# EAGLE schematic Commander (EAGLE 7.7.0)
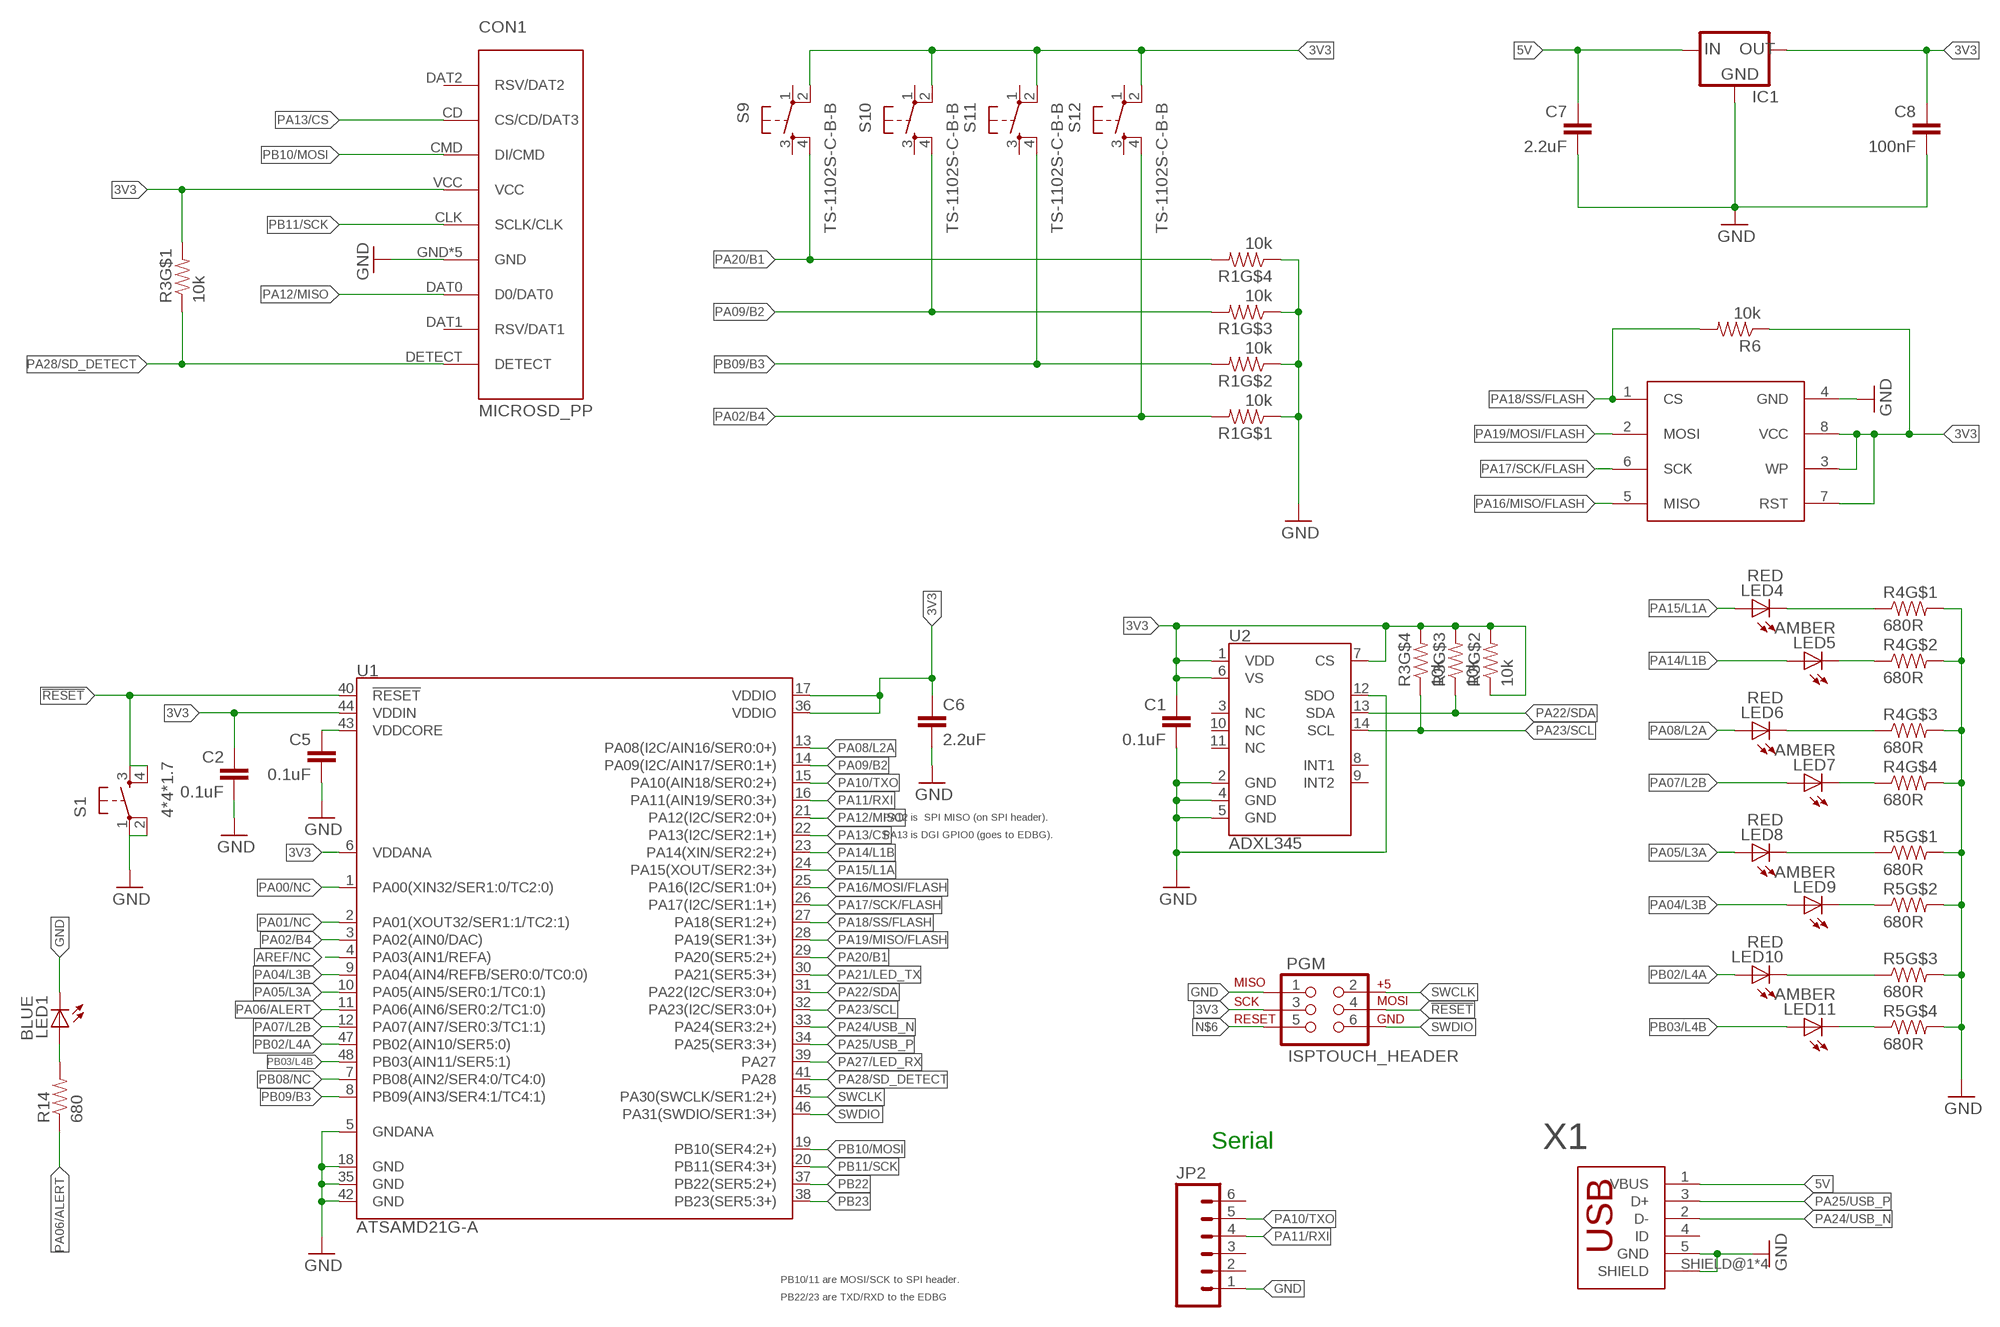
[diagram p0: schematic, sheet 1]

## Parts
C1  0.1uF  CAP0805  [0805]
C2  0.1uF  CAP0805  [0805]
C5  0.1uF  CAP0805  [0805]
C6  2.2uF  CAP0805  [0805]
C7  2.2uF  CAP0805  [0805]
C8  100nF  CAP0805  [0805]
CON1  MICROSD_PP  [MICROSD_PP_NEW]
IC1  VREG-LM1117SOT223  [SOT223]
JP2  M06LOCK  [1X06_LOCK]
LED1  BLUE  LEDCHIPLED_0805  [CHIPLED_0805]
LED4  RED  LEDCHIPLED_0805  [CHIPLED_0805]
LED5  AMBER  LEDCHIPLED_0805  [CHIPLED_0805]
LED6  RED  LEDCHIPLED_0805  [CHIPLED_0805]
LED7  AMBER  LEDCHIPLED_0805  [CHIPLED_0805]
LED8  RED  LEDCHIPLED_0805  [CHIPLED_0805]
LED9  AMBER  LEDCHIPLED_0805  [CHIPLED_0805]
LED10  RED  LEDCHIPLED_0805  [CHIPLED_0805]
LED11  AMBER  LEDCHIPLED_0805  [CHIPLED_0805]
PGM  ISPTOUCH_HEADER  [AVX_9188_6-WAY_MATING_GUIDE]
R1  10k  YC/TC164  [YV/TC164]
R3  10k  YC/TC164  [YV/TC164]
R4  680R  YC/TC164  [YV/TC164]
R5  680R  YC/TC164  [YV/TC164]
R6  10k  RESISTOR0805-RES  [0805]
R14  680  RESISTOR0805-RES  [0805]
S1  4*4*1.7  TACTILE-SWITCH-4PIN4*4*1.7  [BOOMELE-4X4X1.7]
S9  TS-1102S-C-B-B  TACTILE-SWITCH-4PINTS-1102S-C-B-B  [XKB_ENTERPRISE]
S10  TS-1102S-C-B-B  TACTILE-SWITCH-4PINTS-1102S-C-B-B  [XKB_ENTERPRISE]
S11  TS-1102S-C-B-B  TACTILE-SWITCH-4PINTS-1102S-C-B-B  [XKB_ENTERPRISE]
S12  TS-1102S-C-B-B  TACTILE-SWITCH-4PINTS-1102S-C-B-B  [XKB_ENTERPRISE]
U1  ATSAMD21G-A  [TQFP-48]
U2  ADXL345  [LGA-14]
U$1  W25Q128SOIC8  [SOIC8]
X1  ZX62D-B-5PA8SML  [ZX62D-B-5PA8_SMALL]

## Nets
3V3: C1.1 C2.1 C6.1 C8.1 CON1.VCC IC1.2(OUT) IC1.4(OUT) PGM.3 R3.2 R3.3 R3.4 R3.6 R3.8 R6.1 S9.2 S10.2 S11.2 S12.2 U1.6(VDDANA) U1.17(VDDIO) U1.36(VDDIO) U1.44(VDDIN) U2.1(VDD) U2.6(VS) U2.7(CS) U$1.3(WP) U$1.7(RST) U$1.8(VCC)
5V: C7.1 IC1.3(IN) X1.1(VBUS)
!RESET: PGM.4 S1.3 S1.4 U1.40(!RESET!)
AREF/NC: U1.4(PA03(AIN1/REFA))
GND: C1.2 C2.2 C5.2 C6.2 C7.2 C8.2 CON1.GND CON1.GND@1(GND) CON1.GND@2(GND) CON1.GND@3(GND) CON1.GND@4(GND) IC1.1(GND) JP2.1 LED1.C PGM.1 R1.1 R1.3 R1.5 R1.7 R4.2 R4.4 R4.6 R4.8 R5.2 R5.4 R5.6 R5.8 S1.1 S1.2 U1.5(GNDANA) U1.18(GND) U1.35(GND) U1.42(GND) U2.2(GND) U2.4(GND) U2.5(GND) U2.12(SDO) U$1.4(GND) X1.5(GND) X1.SHIELD@1(SHIELD) X1.SHIELD@2(SHIELD) X1.SHIELD@3(SHIELD) X1.SHIELD@4(SHIELD)
N$4: LED1.A R14.2
N$6: PGM.5
N$7: LED4.C R4.1
N$8: LED5.C R4.3
N$9: LED6.C R4.5
N$10: LED7.C R4.7
N$11: LED8.C R5.1
N$12: LED9.C R5.3
N$13: LED10.C R5.5
N$14: LED11.C R5.7
PA00/NC: U1.1(PA00(XIN32/SER1:0/TC2:0))
PA01/NC: U1.2(PA01(XOUT32/SER1:1/TC2:1))
PA02/B4: R1.2 S12.4 U1.3(PA02(AIN0/DAC))
PA04/L3B: LED9.A U1.9(PA04(AIN4/REFB/SER0:0/TC0:0))
PA05/L3A: LED8.A U1.10(PA05(AIN5/SER0:1/TC0:1))
PA06/ALERT: R14.1 U1.11(PA06(AIN6/SER0:2/TC1:0))
PA07/L2B: LED7.A U1.12(PA07(AIN7/SER0:3/TC1:1))
PA08/L2A: LED6.A U1.13(PA08(I2C/AIN16/SER0:0+))
PA09/B2: R1.6 S10.4 U1.14(PA09(I2C/AIN17/SER0:1+))
PA10/TXO: JP2.5 U1.15(PA10(AIN18/SER0:2+))
PA11/RXI: JP2.4 U1.16(PA11(AIN19/SER0:3+))
PA12/MISO: CON1.DAT0(D0/DAT0) U1.21(PA12(I2C/SER2:0+))
PA13/CS: CON1.CD(CS/CD/DAT3) U1.22(PA13(I2C/SER2:1+))
PA14/L1B: LED5.A U1.23(PA14(XIN/SER2:2+))
PA15/L1A: LED4.A U1.24(PA15(XOUT/SER2:3+))
PA16/MISO/FLASH: U$1.5(MISO)
PA16/MOSI/FLASH: U1.25(PA16(I2C/SER1:0+))
PA17/SCK/FLASH: U1.26(PA17(I2C/SER1:1+)) U$1.6(SCK)
PA18/SS/FLASH: R6.2 U1.27(PA18(SER1:2+)) U$1.1(CS)
PA19/MISO/FLASH: U1.28(PA19(SER1:3+))
PA19/MOSI/FLASH: U$1.2(MOSI)
PA20/B1: R1.8 S9.4 U1.29(PA20(SER5:2+))
PA21/LED_TX: U1.30(PA21(SER5:3+))
PA22/SDA: R3.5 U1.31(PA22(I2C/SER3:0+)) U2.13(SDA)
PA23/SCL: R3.7 U1.32(PA23(I2C/SER3:0+)) U2.14(SCL)
PA24/USB_N: U1.33(PA24(SER3:2+)) X1.2(D-)
PA25/USB_P: U1.34(PA25(SER3:3+)) X1.3(D+)
PA27/LED_RX: U1.39(PA27)
PA28/SD_DETECT: CON1.DETECT R3.1 U1.41(PA28)
PB02/L4A: LED10.A U1.47(PB02(AIN10/SER5:0))
PB03/L4B: LED11.A U1.48(PB03(AIN11/SER5:1))
PB08/NC: U1.7(PB08(AIN2/SER4:0/TC4:0))
PB09/B3: R1.4 S11.4 U1.8(PB09(AIN3/SER4:1/TC4:1))
PB10/MOSI: CON1.CMD(DI/CMD) U1.19(PB10(SER4:2+))
PB11/SCK: CON1.CLK(SCLK/CLK) U1.20(PB11(SER4:3+))
PB22: U1.37(PB22(SER5:2+))
PB23: U1.38(PB23(SER5:3+))
SWCLK: PGM.2 U1.45(PA30(SWCLK/SER1:2+))
SWDIO: PGM.6 U1.46(PA31(SWDIO/SER1:3+))
VDDCORE1: C5.1 U1.43(VDDCORE)
Unconnected: CON1.DAT1(RSV/DAT1) CON1.DAT2(RSV/DAT2) JP2.2 JP2.3 JP2.6 S9.1 S9.3 S10.1 S10.3 S11.1 S11.3 S12.1 S12.3 U2.3(NC) U2.8(INT1) U2.9(INT2) U2.10(NC) U2.11(NC) X1.4(ID)

## Notes on the sheet
- PA12 is  SPI MISO (on SPI header).
- PA13 is DGI GPIO0 (goes to EDBG).
- Serial
- PB10/11 are MOSI/SCK to SPI header.
- PB22/23 are TXD/RXD to the EDBG

## Library data of the parts
C1 C2 C5-C8 = 8086NET:CAP: Capacitor Standard 0603 ceramic capacitor, and 0.1" leaded capacitor.
CON1 = 8086NET:MICROSD_PP
IC1 = 8086NET:VREG-LM1117: Voltage Regulator LM1117 Standard adjustable voltage regulator but in SMD form. Spark Fun Electronics SKU : COM-00595
JP2 = 8086NET:M06: Header 6 Standard 6-pin 0.1" header. Use with straight break away headers (SKU : PRT-00116), right angle break away headers (PRT-00553), swiss pins (PRT-00743), machine pins (PRT-00117), and female headers (PRT-00115). Molex polarized connector foot print use with SKU : PRT-08094 with associated crimp pins and housings. NOTES ON THE VARIANTS LOCK and LOCK_LONGPADS... This footprint was designed to help hold the alignment of a through-hole component (i.e. 6-pin header) while soldering it into place. You may notice that each hole has been shifted either up or down by 0.005 of an inch from it's more standard position (which is a perfectly straight line). This slight alteration caused the pins (the squares in the middle) to touch the edges of the holes. Because they are alternating, it causes a "brace" to hold the component in place. 0.005 has proven to be the perfect amount of "off-center" position when using our standard breakaway headers. Although looks a little odd when you look at the bare footprint, once you have a header in there, the alteration is very hard to notice. Also, if you push a header all the way into place, it is covered up entirely on the bottom side. This idea of altering the position of holes to aid alignment will be further integrated into the Sparkfun Library for other footprints. It can help hold any component with 3 or more connection pins.
LED1 LED4-LED11 = 8086NET:LED: LED OSRAM: - CHIPLED LG R971, LG N971, LY N971, LG Q971, LY Q971, LO R971, LY R971 LH N974, LH R974 LS Q976, LO Q976, LY Q976 LO Q996 - Hyper CHIPLED LW Q18S LB Q993, LB Q99A, LB R99A - SideLED LS A670, LO A670, LY A670, LG A670, LP A670 LB A673, LV A673, LT A673, LW A673 LH A674 LY A675 LS A676, LA A676, LO A676, LY A676, LW A676 LS A679, LY A679, LG A679 - Hyper Micro SIDELED® LS Y876, LA Y876, LO Y876, LY Y876 LT Y87S - SmartLED LW L88C, LW L88S LB L89C, LB L89S, LG L890 LS L89K, LO L89K, LY L89K LS L896, LA L896, LO L896, LY L896 - TOPLED LS T670, LO T670, LY T670, LG T670, LP T670 LSG T670, LSP T670, LSY T670, LOP T670, LYG T670 LG T671, LOG T671, LSG T671 LB T673, LV T673, LT T673, LW T673 LH T674 LS T676, LA T676, LO T676, LY T676, LB T676, LH T676, LSB T676, LW T676 LB T67C, LV T67C, LT T67C, LS T67K, LO T67K, LY T67K, LW E67C LS E67B, LA E67B, LO E67B, LY E67B, LB E67C, LV E67C, LT E67C LW T67C LS T679, LY T679, LG T679 LS T770, LO T770, LY T770, LG T770, LP T770 LB T773, LV T773, LT T773, LW T773 LH T774 LS E675, LA E675, LY E675, LS T675 LS T776, LA T776, LO T776, LY T776, LB T776 LHGB T686 LT T68C, LB T68C - Hyper Mini TOPLED® LB M676 - Mini TOPLED Santana® LG M470 LS M47K, LO M47K, LY M47K Source: http://www.osram.convergy.de/
PGM = 8086NET:ISPTOUCH: ISPtouch for AVR Microcontrollers This 6-pin ISP connector for AVR programming does not require any part on the PCB, but an adapter for a common 6-pin programmer. http://daniel-spilker.com/blog/2011/04/25/isptouch-for-avr-microcontrollers/
R1 R3-R5 = 8086NET:YC/TC164
R6 R14 = 8086NET:RESISTOR: Resistor Basic schematic elements and footprints for 0603, 1206, and PTH resistors.
S1 S9-S12 = 8086NET:TACTILE-SWITCH-4PIN: TS-1102S-C-B-B LCSC C381041 BOOMELE4x4x1.7 LCSC C10852
U1 = 8086NET:ATSAMD21G: Atmel SAMD21G SMART ARM-Based Microcontroller The Atmel ® | SMART ™ SAM D21 is a series of low-power microcontrollers using the 32-bit ARM ® Cortex ® -M0+ processor, and ranging from 32- to 64-pins with up to 256KB Flash and 32KB of SRAM. The SAM D21 devices operate at a maximum frequency of 48MHz and reach 2.46 CoreMark/MHz. They are designed for simple and intuitive migration with identical peripheral modules, hex compatible code, identical linear address map and pin compatible migration paths between all devices in the product series. All devices include intelligent and flexible peripherals, Atmel Event System for inter-peripheral signaling, and support for capacitive touch button, slider and wheel user interfaces.; PROD_ID: IC-13064
U2 = SparkFun-Sensors:ADXL345: Analog Devices ADXL345 3-Axis SPI/I2C 2/4/8/16g Accelerometer The ADXL345 is a small, thin, low power, 3-axis accelerometer with high resolution (13-bit) measurement at up to ±16g. Digital output data is formatted as 16-bit twos complement and is accessible through either a SPI (3- or 4-wire) or I2C digital interface. Datasheet <https://www.sparkfun.com/datasheets/Sensors/Accelerometer/ADXL345.pdf> SparkFun Products SparkFun Triple Axis Accelerometer Breakout - ADXL345 <https://www.sparkfun.com/products/9836> (SEN-09836) Triple Axis Accelerometer - ADXL345 <https://www.sparkfun.com/products/9045> (SEN-09045) SparkFun 6 Degrees of Freedom IMU Digital Combo Board - ITG3200/ADXL345 <https://www.sparkfun.com/products/10121> (SEN-10121); PROD_ID: IC-09097; SF_ID: SEN-09045
U$1 = 8086NET:W25Q128
X1 = 8086NET:ZX62D-B-5PA8